# EAGLE design photon_at7020_2 (EAGLE 7.1.0)

## Sheet 1 of 2
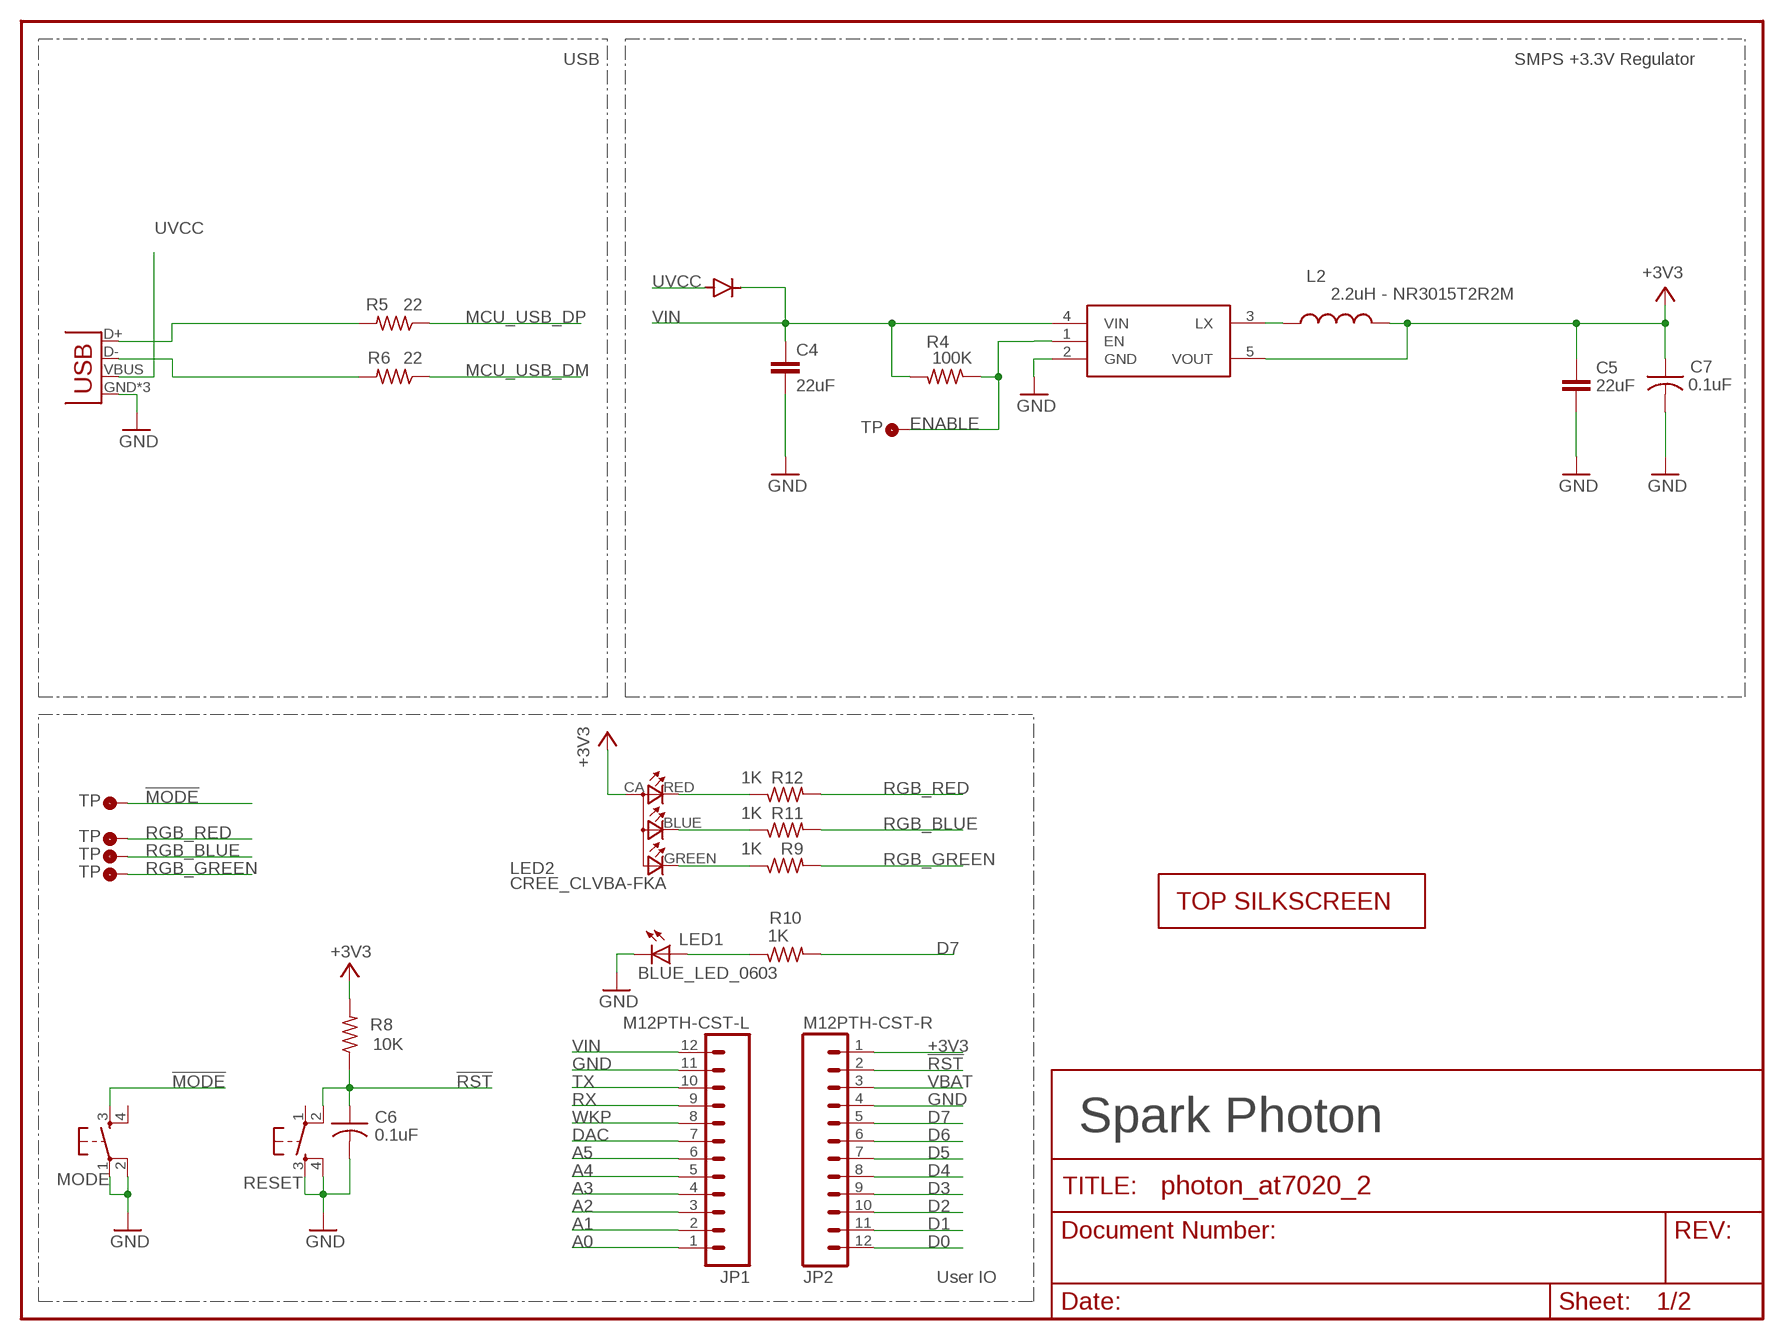
[diagram p0: schematic, sheet 1]

### Parts
BLUE_LED_0603  LED0603  [LED-0603]
C4  22uF  C-EUC0603  [C0603]
C5  22uF  C-EUC0603  [C0603]
C6  0.1uF  C-US  [C0402_B]
C7  0.1uF  C-USC0402  [C0402]
D1  DIODE  [DIODE-DO-220AA(SMP)]
JP1  M12PTH-CST-L  [1X12-CASTELLATED]
JP2  M12PTH-CST-R  [1X12-CASTELLATED]
L2  2.2uH - NR3015T2R2M  INDUCTORB  [INDUCTOR-NR3015]
LED2  CREE_CLVBA-FKA  RGB-LED-CLMVB-FKARGB  [PLCC4-2MM-RGB]
MODE  KMR211GLFS  TAC_SWITCHSMD  [TACTILE_SWITCH_SMD]
R4  100K  R-US_  [R0402_B]
R5  22  R-US_  [R0402_B]
R6  22  R-US_  [R0402_B]
R8  10K  R-US_  [R0402_B]
R9  1K  R-US_  [R0402_B]
R10  1K  R-US_  [R0402_B]
R11  1K  R-US_  [R0402_B]
R12  1K  R-US_  [R0402_B]
RESET  KMR211GLFS  TAC_SWITCHSMD  [TACTILE_SWITCH_SMD]
U$1  PHOTON-TOP-SS  [PHOTON-TOP-SS]
U$3  TP1  [TP35_BOT]
U$5  TP1  [TP35_BOT]
U$6  TP1  [TP35_BOT]
U$7  TP1  [TP35_BOT]
U$11  R8008-33  [SOT23-5]
U$12  TP1  [TP35_BOT]
X1  USB-MICROB  USBUSB-MICROB-SLOT-HOLE  [USB-MICROB-SLOT-HOLE]

### Nets
!MODE: MODE.3 U$3.P$1(TP) ; also sheet 2
!RST: C6.1 JP2.2 R8.1 RESET.2 ; also sheet 2
+3V3: C5.1 C7.1 JP2.1 L2.2 LED2.CA(A2) R8.2 U$11.5(VOUT) ; also sheet 2
A0: JP1.1 ; also sheet 2
A1: JP1.2 ; also sheet 2
A2: JP1.3 ; also sheet 2
A3: JP1.4 ; also sheet 2
A4: JP1.5 ; also sheet 2
A5: JP1.6 ; also sheet 2
D0: JP2.12 ; also sheet 2
D1: JP2.11 ; also sheet 2
D2: JP2.10 ; also sheet 2
D3: JP2.9 ; also sheet 2
D4: JP2.8 ; also sheet 2
D5: JP2.7 ; also sheet 2
D6: JP2.6 ; also sheet 2
D7: JP2.5 R10.2 ; also sheet 2
DAC: JP1.7 ; also sheet 2
ENABLE [vcc]: R4.1 U$11.1(EN) U$12.P$1(TP)
GND: BLUE_LED_0603.C C4.2 C5.2 C6.2 C7.2 JP1.11 JP2.4 MODE.1 MODE.2 RESET.3 RESET.4 U$11.2(GND) X1.GND X1.MT1(GND) X1.MT2(GND) ; also sheet 2
LED1: BLUE_LED_0603.A R10.1
MCU_USB_DM: R6.1 ; also sheet 2
MCU_USB_DP: R5.1 ; also sheet 2
N$1: R5.2 X1.D+
N$3: L2.1 U$11.3(LX)
N$6: R6.2 X1.D-
N$27: LED2.BLUE(CBLUE) R11.1
N$29: LED2.GREEN(CGREEN) R9.1
N$54: LED2.RED(CRED) R12.1
RGB_BLUE: R11.2 U$6.P$1(TP) ; also sheet 2
RGB_GREEN [vcc]: R9.2 U$7.P$1(TP) ; also sheet 2
RGB_RED: R12.2 U$5.P$1(TP) ; also sheet 2
RX: JP1.9 ; also sheet 2
TX: JP1.10 ; also sheet 2
UVCC: D1.ANODE X1.VBUS
VBAT: JP2.3 ; also sheet 2
VIN [vcc]: C4.1 D1.CATHODE JP1.12 R4.2 U$11.4(VIN)
WKP: JP1.8 ; also sheet 2
Unconnected: MODE.4 RESET.1

### Notes on the sheet
- USB | SMPS +3.3V Regulator
- Spark Photon
- User IO

## Sheet 2 of 2
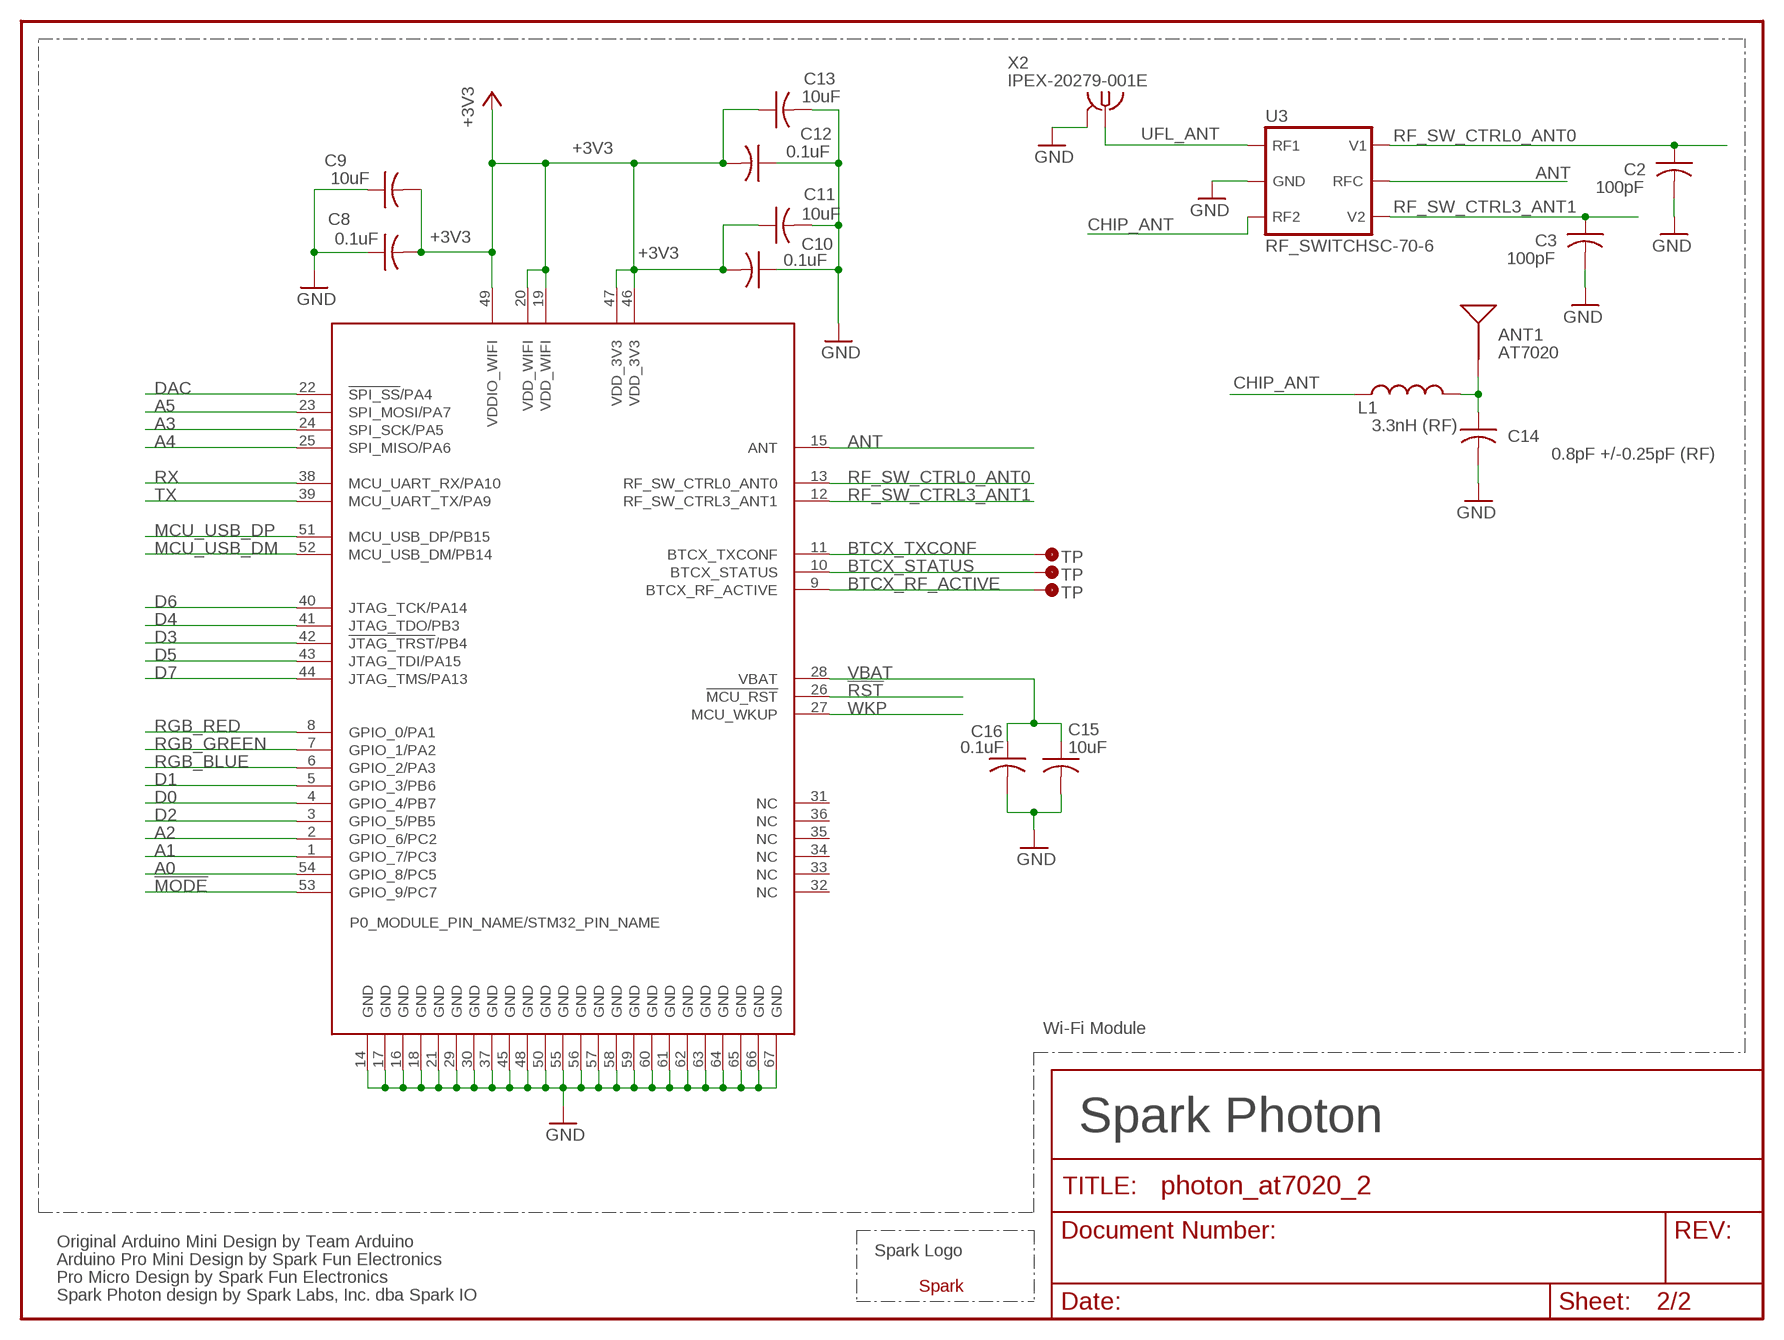
[diagram p1: schematic, sheet 2]

### Parts
ANT1  AT7020  [AT7020]
C2  100pF  C-US  [C0402_B]
C3  100pF  C-US  [C0402_B]
C8  0.1uF  C-US  [C0402_B]
C9  10uF  C-US  [C0402_B]
C10  0.1uF  C-US  [C0402_B]
C11  10uF  C-US  [C0402_B]
C12  0.1uF  C-US  [C0402_B]
C13  10uF  C-US  [C0402_B]
C14  0.8pF +/-0.25pF (RF)  C-US  [C0402_B]
C15  10uF  C-US  [C0402_B]
C16  0.1uF  C-US  [C0402_B]
L1  3.3nH (RF)  INDUCTOR  [L0402_B]
U1  WM-N-BM-09  [WM-N-BM-09]
U3  RF_SWITCHSC-70-6  [SC70-6]
U$2  SPARK_LOGO2  [SPARK_LOGO2]
U$8  TP1  [TP35_BOT]
U$9  TP1  [TP35_BOT]
U$10  TP1  [TP35_BOT]
X2  IPEX-20279-001E  [IPEX-20279-001E]

### Nets
!MODE: U1.53(GPIO_9/PC7) ; also sheet 1
!RST: U1.26(!MCU_RST) ; also sheet 1
+3V3: C8.2 C9.2 C10.2 C11.1 C12.2 C13.1 U1.19(VDD_WIFI) U1.20(VDD_WIFI) U1.46(VDD_3V3) U1.47(VDD_3V3) U1.49(VDDIO_WIFI) ; also sheet 1
A0: U1.54(GPIO_8/PC5) ; also sheet 1
A1: U1.1(GPIO_7/PC3) ; also sheet 1
A2: U1.2(GPIO_6/PC2) ; also sheet 1
A3: U1.24(SPI_SCK/PA5) ; also sheet 1
A4: U1.25(SPI_MISO/PA6) ; also sheet 1
A5: U1.23(SPI_MOSI/PA7) ; also sheet 1
ANT [RF]: U1.15(ANT) U3.5(RFC)
BTCX_RF_ACTIVE: U1.9(BTCX_RF_ACTIVE) U$10.P$1(TP)
BTCX_STATUS: U1.10(BTCX_STATUS) U$9.P$1(TP)
BTCX_TXCONF: U1.11(BTCX_TXCONF) U$8.P$1(TP)
CHIP_ANT [RF]: L1.1 U3.3(RF2)
D0: U1.4(GPIO_4/PB7) ; also sheet 1
D1: U1.5(GPIO_3/PB6) ; also sheet 1
D2: U1.3(GPIO_5/PB5) ; also sheet 1
D3: U1.42(!JTAG_TRST!/PB4) ; also sheet 1
D4: U1.41(JTAG_TDO/PB3) ; also sheet 1
D5: U1.43(JTAG_TDI/PA15) ; also sheet 1
D6: U1.40(JTAG_TCK/PA14) ; also sheet 1
D7: U1.44(JTAG_TMS/PA13) ; also sheet 1
DAC: U1.22(!SPI_SS!/PA4) ; also sheet 1
GND: C2.2 C3.2 C8.1 C9.1 C10.1 C11.2 C12.1 C13.2 C14.2 C15.2 C16.2 U1.14(GND) U1.16(GND) U1.17(GND) U1.18(GND) U1.21(GND) U1.29(GND) U1.30(GND) U1.37(GND) U1.45(GND) U1.48(GND) U1.50(GND) U1.55(GND) U1.56(GND) U1.57(GND) U1.58(GND) U1.59(GND) U1.60(GND) U1.61(GND) U1.62(GND) U1.63(GND) U1.64(GND) U1.65(GND) U1.66(GND) U1.67(GND) U3.2(GND) X2.2@1(GND) X2.2@2(GND) ; also sheet 1
MCU_USB_DM: U1.52(MCU_USB_DM/PB14) ; also sheet 1
MCU_USB_DP: U1.51(MCU_USB_DP/PB15) ; also sheet 1
N$2 [RF]: ANT1.1(SIGNAL) C14.1 L1.2
RF_SW_CTRL0_ANT0: C2.1 U1.13(RF_SW_CTRL0_ANT0) U3.6(V1)
RF_SW_CTRL3_ANT1: C3.1 U1.12(RF_SW_CTRL3_ANT1) U3.4(V2)
RGB_BLUE: U1.6(GPIO_2/PA3) ; also sheet 1
RGB_GREEN [vcc]: U1.7(GPIO_1/PA2) ; also sheet 1
RGB_RED: U1.8(GPIO_0/PA1) ; also sheet 1
RX: U1.38(MCU_UART_RX/PA10) ; also sheet 1
TX: U1.39(MCU_UART_TX/PA9) ; also sheet 1
UFL_ANT [RF]: U3.1(RF1) X2.1
VBAT: C15.1 C16.1 U1.28(VBAT) ; also sheet 1
WKP: U1.27(MCU_WKUP) ; also sheet 1
Unconnected: U1.31(NC) U1.32(NC) U1.33(NC) U1.34(NC) U1.35(NC) U1.36(NC)

### Notes on the sheet
- Wi-Fi Module
- Spark Photon
- Original Arduino Mini Design by Team Arduino
- Spark Logo
- Arduino Pro Mini Design by Spark Fun Electronics
- Pro Micro Design by Spark Fun Electronics
- Spark Photon design by Spark Labs, Inc. dba Spark IO

## Library data of the parts
ANT1 = Spark:AT7020
BLUE_LED_0603 = SparkFun:LED: LEDs Standard schematic elements and footprints for 5mm, 3mm, 1206, and 0603 sized LEDs. 5mm - Spark Fun Electronics SKU : COM-00529 (and others)
C2 C3 C6 C8-C16 = Spark:C-US: Capacitor
C4 C5 = rcl:C-EU: CAPACITOR, European symbol
C7 = adafruit:C-US: CAPACITOR, American symbol
D1 = Spark:DIODE
JP1 JP2 = Spark:M12: Header 12 Standard 12-pin 0.1" header. Use with straight break away headers (SKU : PRT-00116), right angle break away headers (PRT-00553), swiss pins (PRT-00743), machine pins (PRT-00117), and female headers (PRT-00115).
L1 L2 = Spark:INDUCTOR
LED2 = Spark:RGB-LED-CLMVB-FKA: CREE CLMVB-FKA RGB LED 2mm x 2mm
MODE RESET = Spark:TAC_SWITCH: SMD Tactiile Switch
R4-R6 R8-R12 = Spark:R-US_: 0402 Resistor
U1 = Spark:WM-N-BM-09
U3 = Spark:RF_SWITCH: GaAs SPDT Switch DC - 3.0GHz+
U$1 = Spark:PHOTON-TOP-SS
U$2 = Spark:SPARK_LOGO2
U$3 U$5-U$10 U$12 = Spark:TP: Test Points of all sizes and shapes
U$11 = Spark:R8008-33
X1 = Spark:USB
X2 = Spark:IPEX-20279-001E: Ultra Miniature Coaxial SMT RF Receptacle

## Net classes
2 RF: width 0.33 mm, clearance 0.178 mm

## Board
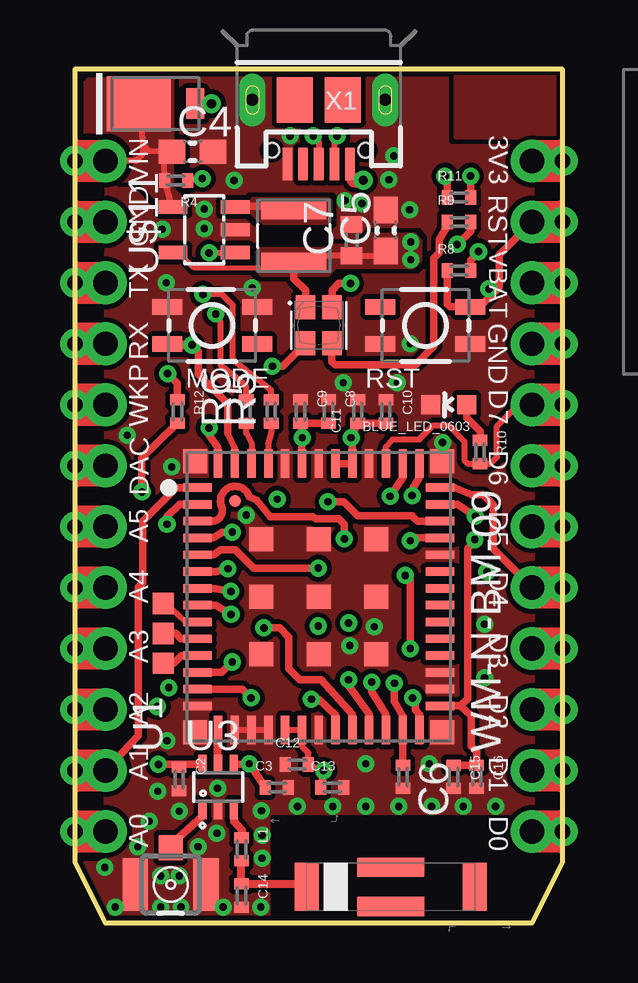
[diagram p2: board, top side]
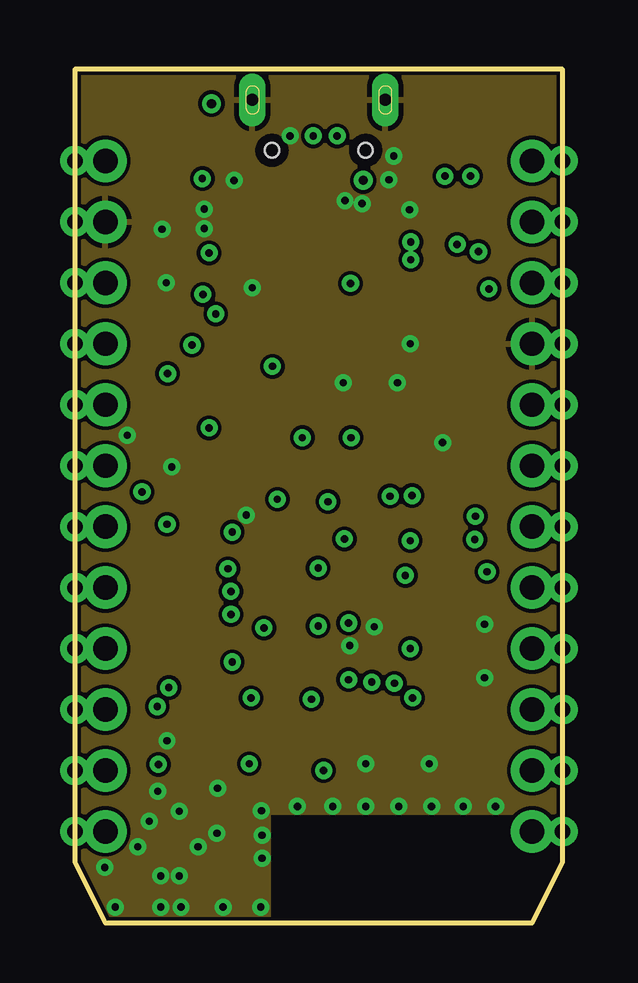
[diagram p3: board, inner layer $GND]
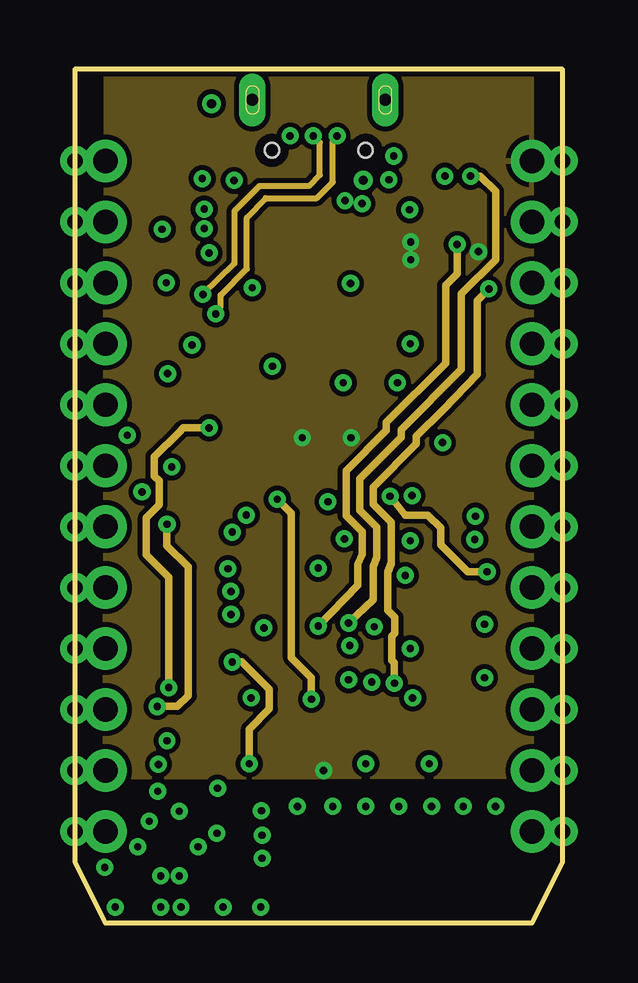
[diagram p4: board, inner layer $+3V3]
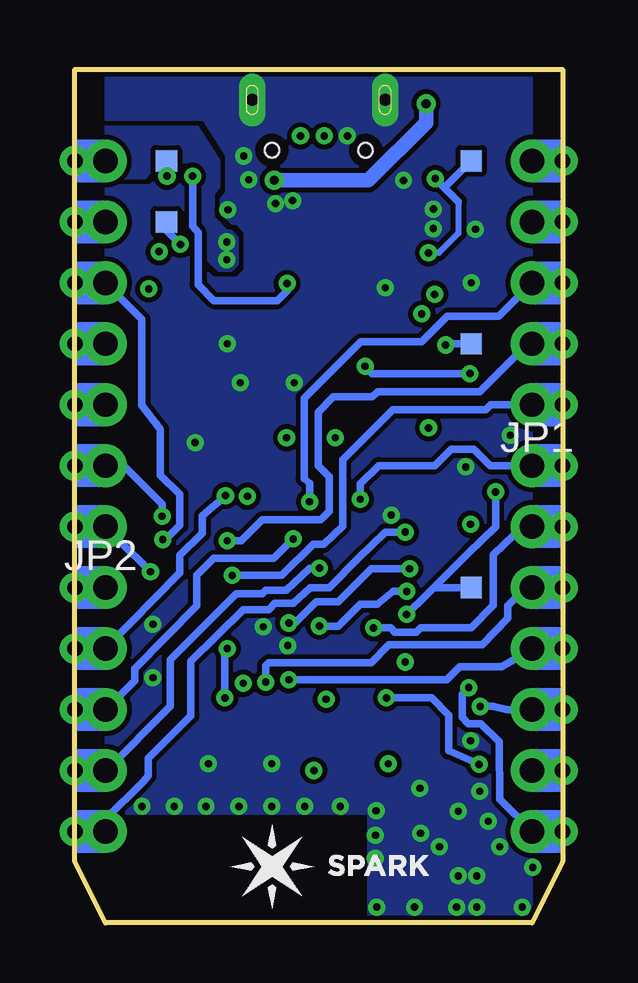
[diagram p5: board, bottom side, seen from below]

Size 20.32 x 35.56 mm. Coordinates in mm from the lower left corner, seen from the top.
Outline: 0,35.56 0,2.54 1.27,0 19.05,0 20.32,2.54 20.32,35.56 0,35.56
Copper layers (1+2*15+16): Top 0.018mm / dielectric 0.195mm / $GND 0.035mm / dielectric 1.1mm / $+3V3 0.035mm / dielectric 0.195mm / Bottom 0.018mm
Design rules "spark": minimum track width 6mil, minimum drill 0.3mm, track to track 6mil, track to pad 6mil, pad to pad 6mil, via to via 6mil, smd to smd 6mil, copper to edge 6mil, drill to drill 6mil, minimum pad ring 12mil, minimum via ring 8mil, stop-mask expansion 4mil, vias tented up to drill 20mil, thermal gap 8mil
tRestrict: area 7.8,28.2 to 10.5,29

### Footprints (pad centres in the part's own frame; a part is rotated, then mirrored left to right if it is on the bottom)
AT7020 = smd 1 x 2: 1 3.5,0; 3 -3.5,0 | smd 2.8 x 0.8: 2 0,0.815; 4 0,-0.815
LED-0603 = smd 0.8 x 0.8: A 0,-0.75; C 0,0.75
C0402_B = smd 0.457 x 0.61: 1 -0.483,0; 2 0.483,0
C0603 = smd 1.1 x 1: 1 -0.85,0; 2 0.85,0
C0402 = smd 0.7 x 0.9: 1 -0.65,0; 2 0.65,0
DIODE-DO-220AA(SMP) = smd 0.762 x 1.27: ANODE 2.349,0 | smd 2.667 x 2.286: CATHODE 0,0
1X12-CASTELLATED = drill 1.016 pad 1.778: 1 0,-13.97; 2 0,-11.43; 3 0,-8.89; 4 0,-6.35; 5 0,-3.81; 6 0,-1.27; 7 0,1.27; 8 0,3.81; 9 0,6.35; 10 0,8.89; 11 0,11.43; 12 0,13.97 | drill 0.635 pad 1.016: @1 1.27,-13.97; @2 1.27,-11.43; @3 1.27,-8.89; @4 1.27,-6.35; @5 1.27,-3.81; @6 1.27,-1.27; @7 1.27,1.27; @8 1.27,3.81; @9 1.27,6.35; @10 1.27,8.89; @11 1.27,11.43; @12 1.27,13.97
L0402_B = smd 0.457 x 0.61: 1 -0.483,0; 2 0.483,0
INDUCTOR-NR3015 = smd 0.8 x 2.7: 1 -1.1,0; 2 1.1,0
PLCC4-2MM-RGB = smd 0.8 x 1: BLUE -0.55,-0.75; CA 0.55,-0.75; GREEN -0.55,0.75; RED 0.55,0.75
TACTILE_SWITCH_SMD = smd 1.25 x 0.65: 1 -1.875,0.775; 2 1.875,0.775; 3 -1.875,-0.775; 4 1.875,-0.775
R0402_B = smd 0.457 x 0.61: 1 -0.483,0; 2 0.483,0
WM-N-BM-09 = smd 0.35 x 1.2: 1 4.55,5.05; 2 3.85,5.05; 3 3.15,5.05; 4 2.45,5.05; 5 1.75,5.05; 6 1.05,5.05; 7 0.35,5.05; 8 -0.35,5.05; 9 -1.05,5.05; 10 -1.75,5.05; 11 -2.45,5.05; 12 -3.15,5.05; 13 -3.85,5.05; 14 -4.55,5.05; 28 -4.55,-5.05; 29 -3.85,-5.05; 30 -3.15,-5.05; 31 -2.45,-5.05; 32 -1.75,-5.05; 33 -1.05,-5.05; 34 -0.35,-5.05; 35 0.35,-5.05; 36 1.05,-5.05; 37 1.75,-5.05; 38 2.45,-5.05; 39 3.15,-5.05; 40 3.85,-5.05; 41 4.55,-5.05 | smd 1.2 x 0.35: 15 -5.55,4.2; 16 -5.55,3.5; 17 -5.55,2.8; 18 -5.55,2.1; 19 -5.55,1.4; 20 -5.55,0.7; 21 -5.55,0; 22 -5.55,-0.7; 23 -5.55,-1.4; 24 -5.55,-2.1; 25 -5.55,-2.8; 26 -5.55,-3.5; 27 -5.55,-4.2; 42 5.55,-4.2; 43 5.55,-3.5; 44 5.55,-2.8; 45 5.55,-2.1; 46 5.55,-1.4; 47 5.55,-0.7; 48 5.55,0; 49 5.55,0.7; 50 5.55,1.4; 51 5.55,2.1; 52 5.55,2.8; 53 5.55,3.5; 54 5.55,4.2 | smd 1 x 1: 55 5.65,5.15; 56 -5.65,5.15; 57 -5.65,-5.15; 58 5.65,-5.15; 59 2.4,2.4; 60 0,2.4; 61 -2.4,2.4; 62 2.4,0; 63 0,0; 64 -2.4,0; 65 2.4,-2.4; 66 0,-2.4; 67 -2.4,-2.4 | smd 0.5 x 0.5: 68 4,3.5
SC70-6 = smd 0.35 x 0.8: 1 -0.65,-0.95; 2 0,-0.95; 3 0.65,-0.95; 4 0.65,0.95; 5 0,0.95; 6 -0.65,0.95
TP35_BOT = smd 0.889 x 0.889 bottom: P$1 0,0
SOT23-5 = smd 0.55 x 1.2: 1 -0.95,-1.3; 2 0,-1.3; 3 0.95,-1.3; 4 0.95,1.3; 5 -0.95,1.3
USB-MICROB-SLOT-HOLE = smd 0.4 x 1.35: D+ 0,2.675; D- -0.65,2.675; GND 1.3,2.675; ID 0.65,2.675; VBUS -1.3,2.675 | drill 0.5 pad 1.1 long: MT1 -2.775,0; MT2 2.775,0 | smd 1.5 x 1.9: P$1 -1,0; P$2 1,0.01 | hole 0.6: -1.95,2.1; 1.95,2.1
IPEX-20279-001E = smd 1 x 1.05: 1 0,1.528 | smd 1.05 x 2.2: 2@1 -1.475,0; 2@2 1.475,0

### Placement (x,y rotation side)
ANT1  13.16,1.5 180 top
BLUE_LED_0603  15.57,21.59 90 top
C2  4.34,5.99 270 top
C3  8.41,5.64 0 top
C4  4.9,32.13 0 top
C5  12.95,28.85 90 top
C6  13.67,6.1 270 top
C7  11.53,28.45 90 top
C8  10.57,21.31 270 top
C9  9.4,21.31 270 top
C10  12.95,21.31 270 top
C11  11.79,21.31 90 top
C12  9.25,6.6 0 top
C13  10.72,5.64 0 top
C14  6.93,1.14 270 top
C15  15.77,6.1 270 top
C16  16.74,6.1 270 top
D1  2.67,34.14 0 top
JP1  1.27,17.78 0 bottom
JP2  19.05,17.78 180 bottom
L1  6.93,3.07 270 top
L2  9.12,28.63 270 top
LED2  10.16,24.89 180 top
MODE  5.71,24.89 0 top
R4  4.22,30.94 180 top
R5  8.18,21.31 90 top
R6  7.14,21.31 90 top
R8  16,27.18 0 top
R9  16,29.21 0 top
R10  16.88,19.62 270 top
R11  16,30.23 0 top
R12  4.27,21.31 270 top
RESET  14.61,24.89 0 top
U1  10.16,13.59 90 top
U3  5.97,5.66 0 top
U$1  0,0 0 top
U$2  16.33,32.89 0 top
U$3  3.81,24.13 0 top
U$5  3.81,13.97 0 top
U$6  16.51,31.75 0 top
U$7  16.51,29.21 0 top
U$8  3.68,10.82 0 bottom
U$9  3.68,12.06 0 bottom
U$10  3.68,13.31 0 bottom
U$11  5.38,28.88 90 top
U$12  3.81,31.75 0 top
X1  10.16,34.29 180 top
X2  3.99,1.6 0 top

### Tracks (layer width: path | path; a pad name or v marks a point on that pad's centre or on a via)
!MODE  (via drill 0.3)
  Top 0.254: U1.53 6.66,19.78 6.38,20.4
  Top 0.305: 6.38,20.4 6.38,21.61 6.26,21.73 5.13,22.86 5.13,23.82 v4.88,24.08 | v4.88,24.08 4.84,24.12 MODE.3 3.88,24.08 v4.88,24.08
  Bottom 0.305: U$3.P$1 4.83,24.13 v4.88,24.08
!RST  (via drill 0.3)
  Top 0.254: U1.26
  Top 0.305: JP2.2 17.68,27.84 17.68,26.49 17.29,26.1 | U1.26 13.66,8.62 13.31,9.25 v13.31,9.98 | C6.1 U1.26 | 16.84,25.65 RESET.2 | v17.25,26.42 17.35,26.21 17.29,26.1 | 17.29,26.1 16.84,25.65 | 16.84,25.65 RESET.2 | R8.1 15.52,25.78 15.63,25.67 RESET.2
  $+3V3 0.305: v13.31,9.98 13.31,10.85 13.21,10.95 13.21,11.94 13.34,12.06 13.34,12.72 13.03,13.03 13.03,14.61 13.18,14.99 13.18,16.69 12.42,17.45 12.42,18.16 14.22,19.96 14.22,20.27 15.34,21.39 16.76,22.86 16.76,25.93 v17.25,26.42
+3V3  (via drill 0.3)
  Top 0: 9.14,27.8 L2.2 | 12.75,27.8 C5.1
  Top 0.203: U$11.5 4.33,27.93 4.95,27.3 7.85,27.3 8.07,27.53 L2.2
  Top 0.254: U1.19 U1.20 9.47,7.34 9.73,7.09 C12.2 | 9.14,27.8 C7.1 12.75,27.8 | 9.8,6.58 v10.36,6.35
  Top 0.305: C12.2 9.8,6.58 | v10.36,6.35 C13.1 | C9.2 9.46,20.83 | C11.1 C10.2 | U1.49 9.46,20.83 | 9.46,20.83 C8.2 | U1.47 U1.46 11.56,20.11 11.56,20.27 C11.1 | v11.51,20.22 C11.1 | 9.46,20.83 9.47,20.81 v9.47,20.22 | LED2.CA 9.61,26.36 9.12,26.85 L2.2 | v16.81,27.97 16.48,27.62 R8.2
  other vias: 14,27.64 14,28.37
  pour $+3V3 (isolate 0.203, rank 2): 1.27,35.56 19.05,35.56 19.05,6.07 1.22,6.02
  pour Top (no thermals): 7.7,28.09 7.54,27.97 7.54,27.15 7.75,26.92 10.57,26.92 10.9,27.25 14.15,27.25 14.48,27.58 14.48,28.42 14.2,28.75 12.34,28.75 11.89,28.3 10.72,28.3 10.54,28.14 7.75,28.14
  pour Bottom (isolate 0.203, no thermals): 13.49,28.57 13.49,27.43 13.79,27.13 14.35,27.13 14.88,27.66 14.88,28.98 15.09,29.21 15.09,30.68 14.88,30.89 14.88,31.34 15.19,31.65 17.12,31.65 17.12,31.27 17.4,30.99 19.08,30.99 19.08,33.22 15.19,33.22 14.27,31.78 14.27,30.63 14.5,30.38 14.5,29.41 13.97,28.88 13.79,28.88
A0  (via drill 0.3)
  Top 0.305: v5.59,20.62 5.59,20.32 5.94,19.81 U1.54
  $+3V3 0.305: v3.91,9.8 3.91,14.4 2.97,15.34 2.97,16.89 3.5,17.42 3.5,18.41 3.3,18.62 3.3,19.43 4.34,20.45 4.52,20.62 v5.59,20.62
  Bottom 0.305: v3.91,9.8 4.19,9.53 4.19,8.56 3.94,8.31 3.4,8.31 2.64,7.54 2.64,7.49 2.62,5.16 JP1.1
A1
  Top 0.305: JP1.2 2.64,7.8 2.64,13.99 2.82,14.17 2.82,16.74 4.22,18.14 U1.1
A2  (via drill 0.3)
  Top 0.305: v3.83,16.61 3.83,16.92 4.36,17.44 U1.2
  $+3V3 0.305: v3.43,9.02 4.27,9.02 4.72,9.47 4.72,14.83 3.83,15.72 v3.83,16.61
  Bottom 0.305: v3.43,9.02 2.92,9.02 2.31,8.89 JP1.3
A3  (via drill 0.3)
  Top 0.305: U1.24 12.26,8.7 11.4,9.88 v11.4,10.13
  Bottom 0.305: JP1.4 2.54,10.67 4.29,10.67 4.83,10.13 v11.4,10.13
A4  (via drill 0.3)
  Top 0.305: U1.25 12.96,8.5 12.95,8.66 12.95,8.69 12.72,9.07 12.37,9.63 v12.37,10.03
  Bottom 0.305: v12.37,10.03 12.37,10.72 12.24,10.85 7.98,10.85 7.24,11.58 3.35,11.58 2.29,12.7 2.29,13.21 1.52,13.97 JP1.5
A5  (via drill 0.3)
  Top 0.305: v7.87,12.29 8.53,12.29 8.91,11.91 8.91,10.59 9.37,10.13 10.26,10.13 11.56,8.68 U1.23
  Bottom 0.305: v7.87,12.29 7.16,12.29 6.99,12.12 6.1,12.12 5.92,12.29 3.81,12.29 2.9,13.23 2.9,15.34 2.41,15.8 1.65,16.51 JP1.6
ANT
  Top 0.254: U3.5 5.96,6.67
  Top 0.33: 5.96,6.67 U1.15
BTCX_RF_ACTIVE
  Top 0.254: 3.76,13.31 4.61,12.54 U1.9
  Top 0.305: U$10.P$1 3.76,13.31
BTCX_STATUS
  Top 0.305: U$9.P$1 4.19,12.06 4.42,11.84 U1.10
BTCX_TXCONF
  Top 0.305: U$8.P$1 4.12,10.82 4.43,11.14 U1.11
CHIP_ANT
  Top 0.33: U3.3 6.62,4.23 6.96,3.86 L1.1
D0  (via drill 0.3)
  Top 0.305: U1.4 5.73,16.04 5.75,16.04 6.15,16.28 v6.55,16.28
  Bottom 0.305: v6.55,16.28 7.39,16.28 8.51,15.19 9.73,13.97 10.52,13.97 11.23,13.31 11.99,13.31 12.24,13.06 13.31,13.06 15.49,10.9 15.49,8.64 17.27,6.86 17.27,6.12 17.5,5.87 19.05,4.32 JP2.12
D1  (via drill 0.3)
  Top 0.305: v10.13,14.78 7.44,14.78 6.68,15.54 6.07,15.54 5.79,15.34 U1.5
  Bottom 0.305: v10.13,14.78 10.54,14.78 11.51,13.87 12.37,13.87 12.52,13.72 13.59,13.72 16.36,10.97 16.36,9.02 19.02,6.35 JP2.11
D2  (via drill 0.3)
  Top 0.305: v11.23,16 11.23,16.61 11,16.84 10.03,16.84 9.91,16.92 8.13,16.92 7.57,17.6 7.26,17.75 arc189 6.12,17.32 arc-118 5.64,16.74 U1.3 | U1.3
  Bottom 0.305: v11.23,16 12.04,15.19 14.53,15.19 15.24,14.48 15.24,13.21 17.83,10.59 17.83,10.08 JP2.10
D3  (via drill 0.3)
  Top 0.305: 14.33,19.11 U1.42 14.35,18.6 14.33,18.52 14.1,18.16 v14.05,17.8
  Bottom 0.305: v14.05,17.8 15.01,16.97 15.01,16.23 15.95,15.32 15.95,14.58 JP2.9
D4
  Top 0.305: U1.41 15.82,18.14 16.54,17.83 17.02,17.83 17.42,17.42 17.42,15.6 JP2.8
D5  (via drill 0.3)
  Top 0.305: U1.43 13.66,18.55 13.66,18.54 13.21,17.88 v13.13,17.78
  $+3V3 0.305: v13.13,17.78 13.77,16.99 14.71,16.99 15.24,16.46 15.24,15.75 16.36,14.63 v17.17,14.63
  Bottom 0.305: JP2.7 18.92,16.33 18.74,16.18 18.51,15.97 v17.17,14.63
D6  (via drill 0.3)
  Top 0.305: U1.40 15.94,17.44 v16.69,16.94
  Bottom 0.305: v16.69,16.94 16.69,17.45 18.29,19.05 JP2.6
D7
  Top 0.254: JP2.5 18.36,21.92 18.36,21.49 17.58,20.7 17.58,19.41 17.31,19.14 R10.2 16.37,19.14 16.23,19.28 16.23,20.07 15.57,20.73 14.94,20.73 14.35,20.14 13.23,20.14 12.96,19.84 U1.44
DAC  (via drill 0.3)
  Top 0.305: U1.22 10.86,8.65 10.16,9.32 v9.86,9.32
  $+3V3 0.305: v9.86,9.32 9.86,10.21 9.02,11.05 9.02,17.07 v8.43,17.65
  Bottom 0.305: v8.43,17.65 8.43,18.29 7.67,19.05 5.33,19.05 4.65,19.74 3.71,19.74 3.02,19.05 JP1.7
ENABLE  (via drill 0.3, 0.3 pad 0.51)
  Top 0.254: R4.1 v5.31,31.01 | v5.59,27.91 5.8,27.92 U$11.1
  Bottom 0.254: 4.34,30.05 4.34,28.73 5.16,27.91 v5.59,27.91
  Bottom 0.305: 4.93,30.63 4.34,30.05 | U$12.P$1 4.93,30.63 | 4.93,30.63 v5.31,31.01
GND  (via drill 0.3)
  Top 0.254: U1.16 U1.17 U1.18 | 8.94,5.66 8.94,5.56 C3.2
  other vias: 2.62,3.17 1.68,0.66 7.75,0.66 6.17,0.66 14.76,6.63 7.77,4.67 1.24,2.31 9.27,4.85 16.18,4.85 13.49,4.85 4.42,0.66 10.74,4.85 12.12,4.85 3.84,7.59 11.25,30.1 5.38,28.93 5.38,29.74 3.63,28.91 8.97,32.79 13.28,31.95 13.94,29.72 15.32,20.02 4.04,19 11.46,11.56 12.47,12.34 3.81,26.67 17.07,10.21 11.18,22.5 17.53,4.85 3.45,5.49 14.86,4.85 7.8,2.69 3.58,0.66 13.44,22.5 7.39,26.47 13.97,24.13 6.63,30.94 13.08,30.96 12.12,6.63 7.14,16.99 2.18,20.32 17.07,12.45 7.8,3.66 5.13,3.17 3.1,4.24 4.34,4.65 5.94,5.61 11.96,29.97 3.58,1.96 4.34,1.96 5.92,3.73
  pour Top (isolate 0.203, rank 3, no thermals): 1.3,35.56 19.08,35.56 19.1,4.57 8.08,4.57 8.08,0 2.84,0.03 1.27,0 0.03,2.51 1.27,2.51 1.27,5.08
  pour $GND: 0,35.56 20.32,35.56 20.32,4.6 8.05,4.6 8.05,0.08 1.32,0.08 0.13,2.54 0.13,3.05
  pour Bottom (isolate 0.203, rank 2, no thermals): 1.3,35.56 19.02,35.56 19.02,4.57 8.08,4.57 8.08,0 1.3,0
  pour Top (no thermals): 6.25,29.16 5.56,29.16 5.56,28.6 6.4,28.6 6.38,28.63 6.38,29.16
GOLDIFY
  pour Top (no thermals): 15.9,35.53 20.29,35.53 20.29,32.77 15.9,32.77
LED1
  Top 0.305: BLUE_LED_0603.A 16.32,21.04 16.88,20.49 R10.1
MCU_USB_DM
  Top 0.254: U1.52 7.36,20 7.14,20.42 R6.1
MCU_USB_DP
  Top 0.254: U1.51 8.05,19.98 8.18,20.44 R5.1
N$1  (via drill 0.3)
  Top 0.254: R5.2 8.18,22.2 6.58,23.47 6.58,25.73 6.12,26.19 v5.33,26.19 | v9.93,32.79 10.16,32.56 X1.D+
  $+3V3 0.254: v5.33,26.19 6.66,27.48 6.66,29.67 7.7,30.71 9.75,30.71 10.21,31.17 10.21,32.51 v9.93,32.79
N$2
  Top 0.33: L1.2 C14.1 9.48,1.63 arc-90 ANT1.1
N$3
  Top 0.305: U$11.3 6.68,29.87 8,29.87 8,29.98 L2.1
  pour Top (no thermals): 6.1,30.1 7.26,30.1 7.39,30.23 7.65,30.23 10.59,30.23 10.69,30.12 10.69,29.24 10.54,29.08 7.85,29.08 7.72,29.21 7.65,29.21 7.29,29.57 6.1,29.57
N$4
  cutout $GND: 7.52,32.19 arc-90 8.21,32.88 8.22,32.88 arc-91 8.9,32.19 arc-88 8.21,31.5 arc-92
N$6  (via drill 0.3)
  Top 0.254: R6.2 7.14,22.38 6.07,23.24 6.07,25.04 v5.87,25.38 | 10.82,31.62 X1.D- 10.81,32.68 v10.92,32.79
  $+3V3 0.254: v5.87,25.38 6.07,25.65 6.07,26.16 7.16,27.25 7.16,29.39 7.95,30.2 10.08,30.2 10.74,30.86 10.74,32.59 v10.92,32.79
N$17
  cutout $GND: 11.42,32.19 arc-90 12.11,32.88 12.12,32.88 arc-91 12.8,32.19 arc-88 12.11,31.5 arc-92
N$18
  cutout $+3V3: 7.52,32.19 arc-90 8.21,32.88 8.22,32.88 arc-91 8.9,32.19 arc-88 8.21,31.5 arc-92
N$19
  cutout $+3V3: 11.42,32.19 arc-90 12.11,32.88 12.12,32.88 arc-91 12.8,32.19 arc-88 12.11,31.5 arc-92
N$20
  cutout Bottom: 7.52,32.19 arc-90 8.21,32.88 8.22,32.88 arc-91 8.9,32.19 arc-88 8.21,31.5 arc-92
N$21
  cutout Bottom: 11.42,32.19 arc-90 12.11,32.88 12.12,32.88 arc-91 12.8,32.19 arc-88 12.11,31.5 arc-92
N$22
  cutout $+3V3: 6.77,33.72 6.77,34.87 arc-90 7.43,35.41 7.44,35.41 arc-90 8,34.85 8,33.76 arc-90 7.47,33.17 arc-90
  cutout $+3V3: 12.32,33.72 12.32,34.85 arc-90 12.88,35.41 12.89,35.41 arc-90 13.55,34.82 13.55,33.76 arc-90 12.81,33.17 arc-90
N$27  (via drill 0.3)
  Top 0.305: R11.1 15.52,30.94 v15.42,31.11 | v11.48,26.64 11,26.64 10.72,26.36 LED2.BLUE
  Bottom 0.305: v15.42,31.11 15.42,29.03 15.19,28.75 15.19,26.59 14.53,25.93 11.89,25.93 11.48,26.34 v11.48,26.64
N$29
  Top 0.305: R9.1 15.47,28.96 15.19,28.47 15.19,27.91 14.96,27.69 14.96,24.03 14.2,23.27 10.85,23.27 10.71,23.38 LED2.GREEN
N$54  (via drill 0.3)
  Top 0.305: R12.1 4.27,22.48 v3.86,22.89 | v8.23,23.19 8.66,23.19 LED2.RED
  Bottom 0.305: v3.86,22.89 7.92,22.89 v8.23,23.19
RF_SW_CTRL0_ANT0  (via drill 0.3)
  Top 0.305: U3.6 4.72,6.61 v3.48,6.6 4.22,6.6 C2.1 | v7.34,9.37 6.97,9.74 U1.13
  Bottom 0.305: v3.48,6.6 4.75,7.16 4.75,8.66 5.46,9.37 v7.34,9.37
RF_SW_CTRL3_ANT1  (via drill 0.3)
  Top 0.254: 7.26,6.61 v7.26,6.63
  Top 0.305: U3.4 7.26,6.61 | v6.55,10.87 6.12,10.44 U1.12 | C3.1 7.34,6.53 v7.26,6.63
  $+3V3 0.305: v7.26,6.63 7.26,8.08 8.1,8.91 8.1,9.73 6.96,10.87 v6.55,10.87
RGB_BLUE  (via drill 0.3)
  Top 0.305: U1.6 5.88,14.64 6.27,14.73 v6.38,14.76 | v16.48,31.11 R11.2
  $+3V3 0.305: v11.4,12.5 12.42,13.46 12.42,14.83 12.57,15.24 12.57,16.48 11.86,17.2 11.86,18.52 13.59,20.24 13.59,20.55 16.1,23.06 16.1,26.21 17.53,27.64 17.53,30.48 16.89,31.11 v16.48,31.11
  Bottom 0.254: U$6.P$1 v16.48,31.11
  Bottom 0.305: v6.38,14.76 7.98,14.76 9.35,13.39 10.26,13.39 11.15,12.5 v11.4,12.5
RGB_GREEN  (via drill 0.3)
  Top 0.305: U1.7 5.87,13.92 v6.5,13.81 | v15.93,28.27 16.48,28.83 R9.2 U$7.P$1
  $+3V3 0.305: v10.13,12.37 11.79,14.07 11.79,14.94 11.96,15.37 11.96,16.31 11.3,16.97 11.3,18.85 12.98,20.52 12.98,20.85 15.44,23.32 15.44,26.57 15.93,27.05 v15.93,28.27
  Bottom 0.305: v6.5,13.81 7.07,13.81 7.72,13.28 8.43,13.28 9.35,12.37 v10.13,12.37 | U$7.P$1 16.51,28.85 v15.93,28.27
RGB_RED  (via drill 0.3)
  Top 0.305: U1.8 5.86,13.24 v6.5,12.85 | v2.79,17.96 2.79,19.38 3.38,19.96 R12.2
  Bottom 0.305: v6.5,12.85 6.27,13.08 5.89,13.44 5.37,13.96 | 5.37,13.96 3.91,15.42 2.79,16.51 v2.79,17.96 | U$5.P$1 3.82,13.96 5.37,13.96
RX  (via drill 0.3)
  Top 0.305: v13.97,15.93 14.08,16.04 U1.38
  Bottom 0.305: JP1.9 1.91,23.67 3.45,22.12 7.7,22.12 7.92,21.92 9.55,21.92 10.19,21.29 10.19,19.05 9.73,18.59 9.73,17.14 10.08,16.79 12.52,16.79 13.39,15.93 v13.97,15.93
TX  (via drill 0.3)
  Top 0.305: v10.54,17.55 11.2,17.55 11.79,16.97 14.05,16.97 14.15,16.87 14.28,16.74 U1.39
  Bottom 0.305: JP1.10 2.67,25.27 4.8,25.27 5.87,24.21 8.41,24.21 10.77,21.87 10.77,18.52 10.54,18.31 v10.54,17.55
UFL_ANT
  Top 0.254: U3.1 5.32,4.43 | 3.94,3.2 X2.1
  Top 0.33: 5.32,4.43 3.94,3.2
UVCC  (via drill 0.38)
  Top 0.254: 11.53,31.04 11.53,31.54 X1.VBUS
  Top 0.508: 11.63,30.94 11.53,31.04
  Top 0.61: D1.ANODE v5.69,34.14 | v12.01,30.94 11.63,30.94
  Bottom 0.61: v5.69,34.14 5.69,33.35 8.1,30.94 v12.01,30.94
VBAT  (via drill 0.3)
  Top 0.254: U1.28 15.23,9.04 16.05,9.04
  Top 0.305: 16.06,9.04 16.51,8.64 16.51,7.37 16.74,7.14 C16.1 C15.1 | 16.06,9.04 U1.28 | v16.66,15.98 16.36,15.6 16.36,9.34 16.06,9.04
  Bottom 0.305: JP2.3 17.53,25.15 17.53,21.57 16.76,20.57 16.76,18.64 15.95,17.86 15.95,16.56 16.54,15.98 v16.66,15.98
VIN
  Top 0.254: D1.CATHODE 2.82,32.44 | 2.82,32.44 3.07,32.18 C4.1 3.72,31.71 R4.2 4.04,29.88 U$11.4 | 2.82,32.44 2.82,32.03 2.54,31.75 JP1.12
  pour Top (isolate 0.254, no thermals): 0,31.27 0,34.67 0.89,35.56 4.14,35.56 4.14,32.41 4.11,31.72 4.11,30.66 4.22,30.56 4.67,30.07 3.51,29.97 3.38,30.1 2.77,30.73 2.64,30.86 1.22,30.86
WKP  (via drill 0.3)
  Top 0.305: U1.27 14.36,8.68 14.17,8.89 14.17,9.04 v14.07,9.37 | v13.97,11.43 13.97,14.28 v13.77,14.48
  Bottom 0.305: v14.07,9.37 14.07,11.33 v13.97,11.43 | v13.77,14.48 11.71,14.48 10.39,15.77 9.96,15.77 9.17,16.54 9.17,19.3 7.09,21.39 3.2,21.39 3,21.59 JP1.8

### Text on the board
tDocu: NOTES: / / Layer stack up: / 1 - GTL - Top Copper / 2 - G2L - Inner Ground / 15 - G15L - Inner +3.3V / 16 - GBL - Bottom Copper